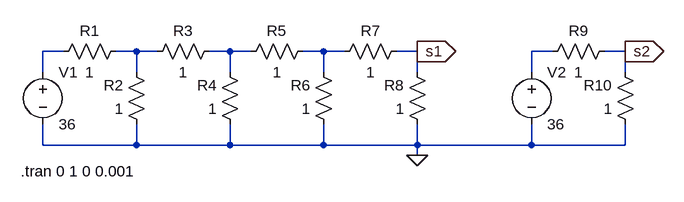
[diagram p0: schematic g2_p7.asc]
g2_p7.asc, the LTspice schematic file:
Version 4
SHEET 1 984 680
WIRE 32 128 0 128
WIRE 144 128 112 128
WIRE 176 128 144 128
WIRE 288 128 256 128
WIRE 320 128 288 128
WIRE 432 128 400 128
WIRE 464 128 432 128
WIRE 576 128 544 128
WIRE 784 128 752 128
WIRE 896 128 864 128
WIRE 0 160 0 128
WIRE 144 160 144 128
WIRE 288 160 288 128
WIRE 432 160 432 128
WIRE 576 160 576 128
WIRE 752 160 752 128
WIRE 896 160 896 128
WIRE 0 272 0 240
WIRE 144 272 144 240
WIRE 144 272 0 272
WIRE 288 272 288 240
WIRE 288 272 144 272
WIRE 432 272 432 240
WIRE 432 272 288 272
WIRE 576 272 576 240
WIRE 576 272 432 272
WIRE 752 272 752 240
WIRE 752 272 576 272
WIRE 896 272 896 240
WIRE 896 272 752 272
WIRE 576 288 576 272
FLAG 576 288 0
FLAG 576 128 s1
IOPIN 576 128 Out
FLAG 896 128 s2
IOPIN 896 128 Out
SYMBOL res 128 112 R90
WINDOW 0 0 56 VBottom 2
WINDOW 3 32 56 VTop 2
SYMATTR InstName R1
SYMATTR Value 1
SYMBOL res 160 256 R180
WINDOW 0 36 76 Left 2
WINDOW 3 36 40 Left 2
SYMATTR InstName R2
SYMATTR Value 1
SYMBOL res 272 112 R90
WINDOW 0 0 56 VBottom 2
WINDOW 3 32 56 VTop 2
SYMATTR InstName R3
SYMATTR Value 1
SYMBOL res 304 256 R180
WINDOW 0 36 76 Left 2
WINDOW 3 36 40 Left 2
SYMATTR InstName R4
SYMATTR Value 1
SYMBOL res 416 112 R90
WINDOW 0 0 56 VBottom 2
WINDOW 3 32 56 VTop 2
SYMATTR InstName R5
SYMATTR Value 1
SYMBOL res 448 256 R180
WINDOW 0 36 76 Left 2
WINDOW 3 36 40 Left 2
SYMATTR InstName R6
SYMATTR Value 1
SYMBOL res 560 112 R90
WINDOW 0 0 56 VBottom 2
WINDOW 3 32 56 VTop 2
SYMATTR InstName R7
SYMATTR Value 1
SYMBOL res 592 256 R180
WINDOW 0 36 76 Left 2
WINDOW 3 36 40 Left 2
SYMATTR InstName R8
SYMATTR Value 1
SYMBOL res 880 112 R90
WINDOW 0 0 56 VBottom 2
WINDOW 3 32 56 VTop 2
SYMATTR InstName R9
SYMATTR Value 1
SYMBOL res 912 256 R180
WINDOW 0 36 76 Left 2
WINDOW 3 36 40 Left 2
SYMATTR InstName R10
SYMATTR Value 1
SYMBOL voltage 0 144 R0
WINDOW 123 0 0 Left 0
WINDOW 39 0 0 Left 0
SYMATTR InstName V1
SYMATTR Value 36
SYMBOL voltage 752 144 R0
WINDOW 123 0 0 Left 0
WINDOW 39 0 0 Left 0
SYMATTR InstName V2
SYMATTR Value 36
TEXT -34 312 Left 2 !.tran 0 1 0 0.001

The netlist it stands for:
* g2_p7.asc
R1 N002 N001 1
R2 0 N002 1
R3 N003 N002 1
R4 0 N003 1
R5 N004 N003 1
R6 0 N004 1
R7 s1 N004 1
R8 0 s1 1
R9 s2 N005 1
R10 0 s2 1
V1 N001 0 36
V2 N005 0 36
.tran 0 1 0 0.001
.backanno
.end